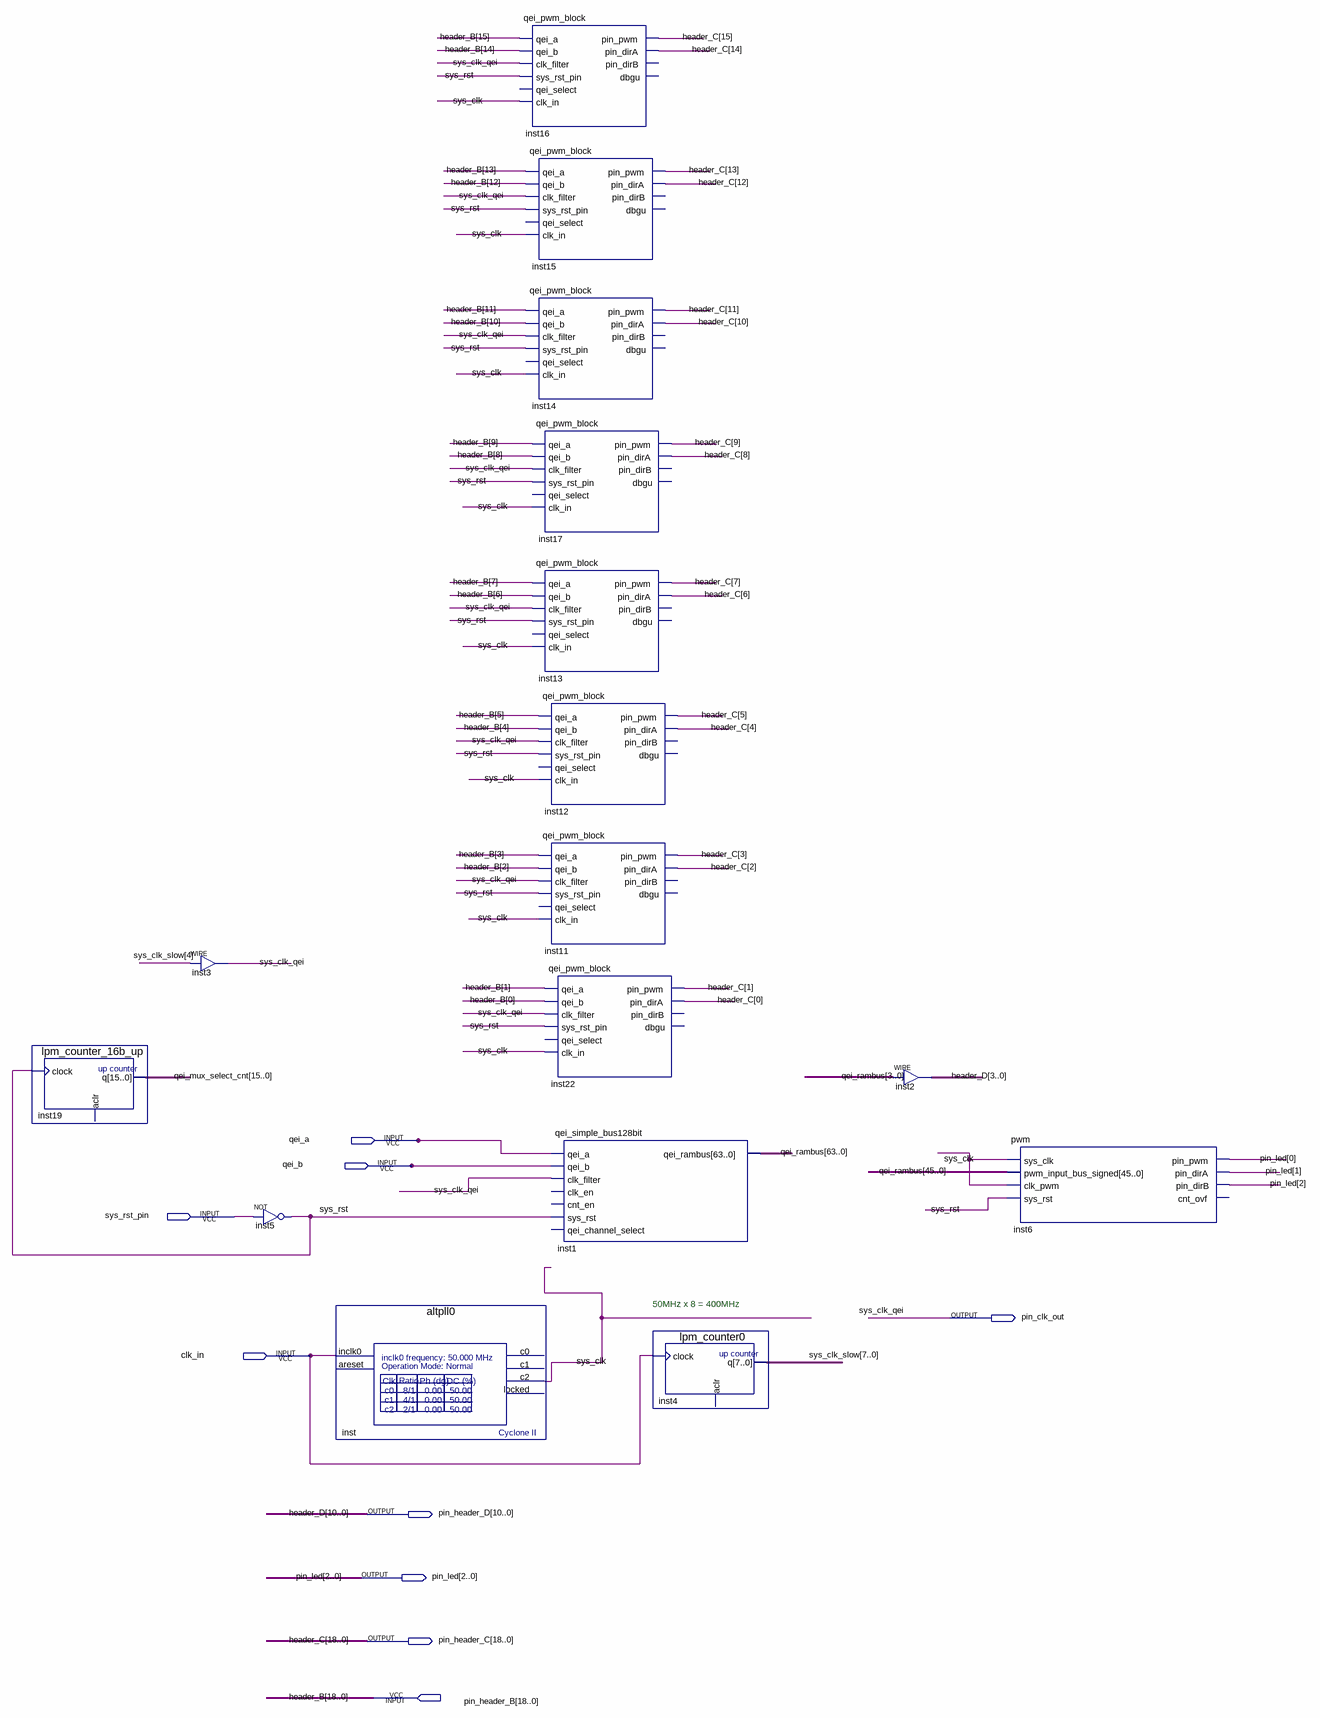
[diagram p0: schematic sheet]
// Quartus schematic teszt1.bdf as structural Verilog: 16 symbols, 9 pins
module teszt1 (
  input  qei_a,
  input  qei_b,
  input  sys_rst_pin,
  input  clk_in,
  input  [18:0] pin_header_B,
  output pin_clk_out,
  output [10:0] pin_header_D,
  output [2:0] pin_led,
  output [18:0] pin_header_C
);

  wire sys_clk, sys_rst;
  wire [7:0] sys_clk_slow;
  wire [15:0] qei_mux_select_cnt;
  wire [63:0] qei_rambus;

  lpm_counter_16b_up inst19 (.clock(sys_rst), .q(qei_mux_select_cnt));  // open: aclr
  assign pin_clk_out = sys_clk_slow[4];  // WIRE inst3
  not inst5 (sys_rst, sys_rst_pin);
  altpll0 inst (.inclk0(clk_in), .c2(sys_clk));  // open: areset, c0, c1, locked
  qei_pwm_block inst16 (
    .qei_a(pin_header_B[15]), .qei_b(pin_header_B[14]), .clk_filter(pin_clk_out), .sys_rst_pin(sys_rst),
    .clk_in(sys_clk), .pin_pwm(pin_header_C[15]), .pin_dirA(pin_header_C[14]));  // open: qei_select, pin_dirB, dbgu
  qei_pwm_block inst15 (
    .qei_a(pin_header_B[13]), .qei_b(pin_header_B[12]), .clk_filter(pin_clk_out), .sys_rst_pin(sys_rst),
    .clk_in(sys_clk), .pin_pwm(pin_header_C[13]), .pin_dirA(pin_header_C[12]));  // open: qei_select, pin_dirB, dbgu
  qei_pwm_block inst14 (
    .qei_a(pin_header_B[11]), .qei_b(pin_header_B[10]), .clk_filter(pin_clk_out), .sys_rst_pin(sys_rst),
    .clk_in(sys_clk), .pin_pwm(pin_header_C[11]), .pin_dirA(pin_header_C[10]));  // open: qei_select, pin_dirB, dbgu
  qei_pwm_block inst17 (
    .qei_a(pin_header_B[9]), .qei_b(pin_header_B[8]), .clk_filter(pin_clk_out), .sys_rst_pin(sys_rst),
    .clk_in(sys_clk), .pin_pwm(pin_header_C[9]), .pin_dirA(pin_header_C[8]));  // open: qei_select, pin_dirB, dbgu
  qei_pwm_block inst13 (
    .qei_a(pin_header_B[7]), .qei_b(pin_header_B[6]), .clk_filter(pin_clk_out), .sys_rst_pin(sys_rst),
    .clk_in(sys_clk), .pin_pwm(pin_header_C[7]), .pin_dirA(pin_header_C[6]));  // open: qei_select, pin_dirB, dbgu
  qei_pwm_block inst12 (
    .qei_a(pin_header_B[5]), .qei_b(pin_header_B[4]), .clk_filter(pin_clk_out), .sys_rst_pin(sys_rst),
    .clk_in(sys_clk), .pin_pwm(pin_header_C[5]), .pin_dirA(pin_header_C[4]));  // open: qei_select, pin_dirB, dbgu
  qei_pwm_block inst11 (
    .qei_a(pin_header_B[3]), .qei_b(pin_header_B[2]), .clk_filter(pin_clk_out), .sys_rst_pin(sys_rst),
    .clk_in(sys_clk), .pin_pwm(pin_header_C[3]), .pin_dirA(pin_header_C[2]));  // open: qei_select, pin_dirB, dbgu
  qei_pwm_block inst22 (
    .qei_a(pin_header_B[1]), .qei_b(pin_header_B[0]), .clk_filter(pin_clk_out), .sys_rst_pin(sys_rst),
    .clk_in(sys_clk), .pin_pwm(pin_header_C[1]), .pin_dirA(pin_header_C[0]));  // open: qei_select, pin_dirB, dbgu
  qei_simple_bus128bit inst1 (
    .qei_a(qei_a), .qei_b(qei_b), .clk_filter(pin_clk_out), .sys_rst(sys_rst), .qei_rambus(qei_rambus));  // open: clk_en, cnt_en, qei_channel_select
  lpm_counter0 inst4 (.clock(clk_in), .q(sys_clk_slow));  // open: aclr
  assign pin_header_D[3:0] = qei_rambus[3:0];  // WIRE inst2
  pwm inst6 (
    .sys_clk(sys_clk), .pwm_input_bus_signed(qei_rambus[45:0]), .clk_pwm(sys_clk), .sys_rst(sys_rst),
    .pin_pwm(pin_led[0]), .pin_dirA(pin_led[1]), .pin_dirB(pin_led[2]));  // open: cnt_ovf

  // Other names for the same wires on the sheet: header_B[18:0] = pin_header_B; header_C[18:0] = pin_header_C;
  //   header_D[10:0] = pin_header_D; sys_clk_qei = pin_clk_out

  // Notes on the sheet:
  //   50MHz x 8 = 400MHz
endmodule
